# Altium schematic sheet Interface_BUS.SchDoc
size A4; Author: Audran; CompanyName: Goldorak; Address1: Electrolab; Address2: 52 rue Paul Lescop; Address3: 92000 Nanterre; DocumentNumber: 7; SheetNumber: 7; SheetTotal: 8; ProjectName: Cartes_2017
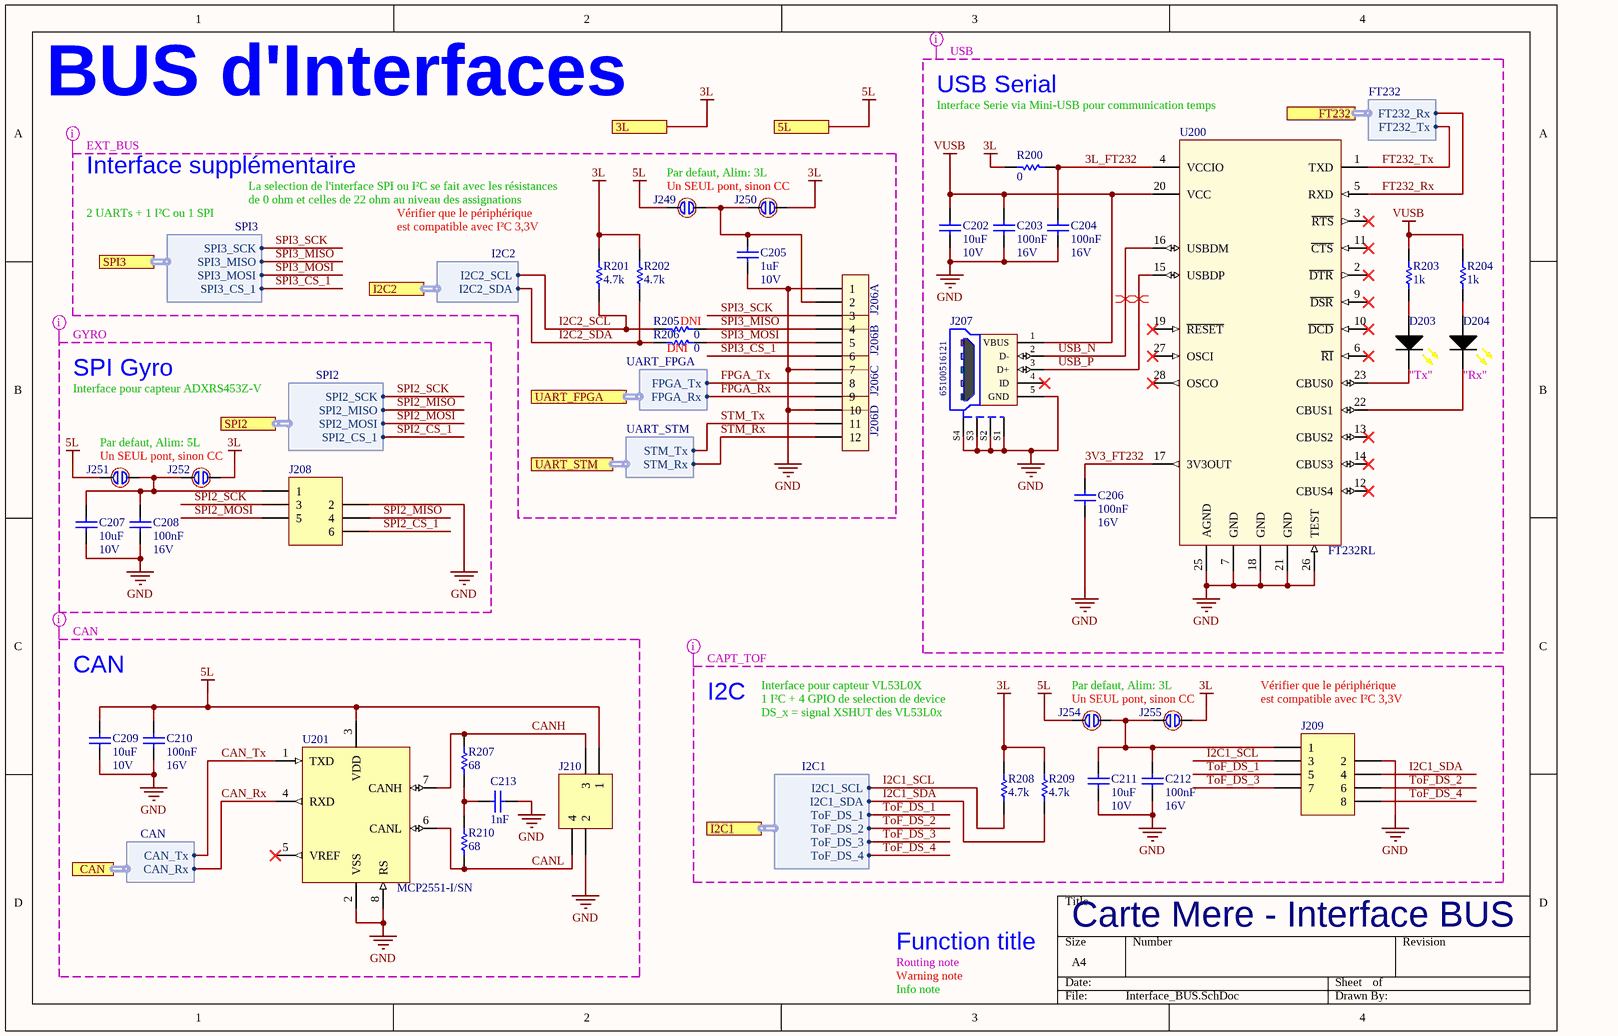
[diagram p0: Interface_BUS.SchDoc]

## Parts
C202  10uF  RatedVoltage: 10V  [WCAP-CSGP_0805, 2x1.25x1.25]
C203  100nF  RatedVoltage: 16V  [WCAP-CSGP_0402, 1x0.5x0.5]
C204  100nF  RatedVoltage: 16V  [WCAP-CSGP_0402, 1x0.5x0.5]
C205  1uF  RatedVoltage: 10V  [WCAP-CSGP_0402, 1x0.5x0.5]
C206  100nF  RatedVoltage: 16V  [WCAP-CSGP_0402, 1x0.5x0.5]
C207  10uF  RatedVoltage: 10V  [WCAP-CSGP_0805, 2x1.25x1.25]
C208  100nF  RatedVoltage: 16V  [WCAP-CSGP_0402, 1x0.5x0.5]
C209  10uF  RatedVoltage: 10V  [WCAP-CSGP_0805, 2x1.25x1.25]
C210  100nF  RatedVoltage: 16V  [WCAP-CSGP_0402, 1x0.5x0.5]
C211  10uF  RatedVoltage: 10V  [WCAP-CSGP_0805, 2x1.25x1.25]
C212  100nF  RatedVoltage: 16V  [WCAP-CSGP_0402, 1x0.5x0.5]
C213  1nF  [WCAP-CSGP_0402, 1x0.5x0.5]
D203  150060YS75000  [SMCW_0603]  (value not drawn)
D204  150060YS75000  [SMCW_0603]  (value not drawn)
J206  TSW-104-08-F-T-RA  [TSW-104-08-F-T-RA]  (value not drawn)  (parts A,B,C,D of 4)
J207  65100516121  [65100516121]
J208  690367280676  [690367280676]  (value not drawn)
J209  690367280876  [690367280876]  (value not drawn)
J210  690367280476  [690367280476]  (value not drawn)
J249  open  [CAVALIER]  (value not drawn)  (no BOM)
J250  open  [CAVALIER]  (value not drawn)  (no BOM)
J251  open  [CAVALIER]  (value not drawn)  (no BOM)
J252  open  [CAVALIER]  (value not drawn)  (no BOM)
J254  open  [CAVALIER]  (value not drawn)  (no BOM)
J255  open  [CAVALIER]  (value not drawn)  (no BOM)
R200  value 0  [RESC1608X06N]  (hidden comment: RC0603FR-070RL)
R201  value 4.7k  [RESC1005X04N]  (hidden comment: RC0402FR-074K7L)
R202  value 4.7k  [RESC1005X04N]  (hidden comment: RC0402FR-074K7L)
R203  value 1k  [RESC1005X04N]  (hidden comment: RC0402FR-071KL)
R204  value 1k  [RESC1005X04N]  (hidden comment: RC0402FR-071KL)
R205  value 0  [RESC1608X06N]  (hidden comment: RC0603FR-070RL)
R206  value 0  [RESC1608X06N]  (hidden comment: RC0603FR-070RL)
R207  value 68  [RESC1608X06N]  (hidden comment: RC0603FR-0768RL)
R208  value 4.7k  [RESC1005X04N]  (hidden comment: RC0402FR-074K7L)
R209  value 4.7k  [RESC1005X04N]  (hidden comment: RC0402FR-074K7L)
R210  value 68  [RESC1608X06N]  (hidden comment: RC0603FR-0768RL)
U200  FT232RL  [SSOP28]
U201  MCP2551-I/SN  [SOIC127P600X175-8N]

## Ports
3L, 5L, CAN (harness CAN), FT232 (harness FT232), I2C1 (harness I2C1), I2C2 (harness I2C2), SPI2 (harness SPI2), SPI3 (harness SPI3), UART_FPGA (harness UART_FPGA), UART_STM (harness UART_STM)

## Harnesses
I2C1: I2C1_SCL, I2C1_SDA, ToF_DS_1, ToF_DS_2, ToF_DS_3, ToF_DS_4
SPI2: SPI2_SCK, SPI2_MISO, SPI2_MOSI, SPI2_CS_1
CAN: CAN_Rx, CAN_Tx
FT232: FT232_Tx, FT232_Rx
SPI3: SPI3_SCK, SPI3_MISO, SPI3_MOSI, SPI3_CS_1
I2C2: I2C2_SCL, I2C2_SDA
UART_FPGA: FPGA_Tx, FPGA_Rx
UART_STM: STM_Tx, STM_Rx

## Nets
3L: J250.2 J252.2 J255.2 R200.1 R201.2 R202.2 R208.2 R209.2 ; port 3L
5L: C209.1 C210.1 J210.1 J249.1 J251.1 J254.1 U201.3(VDD) ; port 5L
GND: C202.2 C203.2 C204.2 C205.2 C206.2 C207.2 C208.2 C209.2 C210.2 C211.2 C212.2 C213.2 J206.1 J206.7 J206.10 J207.5(GND) J207.S1(Shield) J207.S2(Shield) J207.S3(Shield) J207.S4(Shield) J208.2 J209.2 J210.2 U200.7(GND) U200.18(GND) U200.21(GND) U200.25(AGND) U200.26(TEST) U201.2(VSS) U201.8(RS)
VUSB: C202.1 C203.1 J207.1(VBUS) R203.1 R204.1 U200.20(VCC)
3L_FT232: C204.1 R200.2 U200.4(VCCIO)
3V3_FT232: C206.1 U200.17(3V3OUT)
CAN_Rx: U201.4(RXD) ; port CAN.CAN_Rx
CAN_Tx: U201.1(TXD) ; port CAN.CAN_Tx
CANH: J210.3 R207.2 U201.7(CANH)
CANL: J210.4 R210.1 U201.6(CANL)
FPGA_Rx: J206.9 ; port UART_FPGA.FPGA_Rx
FPGA_Tx: J206.8 ; port UART_FPGA.FPGA_Tx
FT232_Rx: U200.5(RXD) ; port FT232.FT232_Rx
FT232_Tx: U200.1(TXD) ; port FT232.FT232_Tx
I2C1_SCL: J209.3 R208.1 ; port I2C1.I2C1_SCL
I2C1_SDA: J209.4 R209.1 ; port I2C1.I2C1_SDA
I2C2_SCL: R201.1 R205.1 ; port I2C2.I2C2_SCL
I2C2_SDA: R202.1 R206.1 ; port I2C2.I2C2_SDA
SPI2_CS_1: J208.6 ; port SPI2.SPI2_CS_1
SPI2_MISO: J208.4 ; port SPI2.SPI2_MISO
SPI2_MOSI: J208.5 ; port SPI2.SPI2_MOSI
SPI2_SCK: J208.3 ; port SPI2.SPI2_SCK
SPI3_CS_1: J206.6 ; port SPI3.SPI3_CS_1
SPI3_MISO: J206.4 R205.2 ; port SPI3.SPI3_MISO
SPI3_MOSI: J206.5 R206.2 ; port SPI3.SPI3_MOSI
SPI3_SCK: J206.3 ; port SPI3.SPI3_SCK
STM_Rx: J206.12 ; port UART_STM.STM_Rx
STM_Tx: J206.11 ; port UART_STM.STM_Tx
ToF_DS_1: J209.5 ; port I2C1.ToF_DS_1
ToF_DS_2: J209.6 ; port I2C1.ToF_DS_2
ToF_DS_3: J209.7 ; port I2C1.ToF_DS_3
ToF_DS_4: J209.8 ; port I2C1.ToF_DS_4
USB_N: J207.2(D-) U200.16(USBDM)
USB_P: J207.3(D+) U200.15(USBDP)
NetC205_1: C205.1 J206.2 J249.2 J250.1
NetC207_1: C207.1 C208.1 J208.1 J251.2 J252.1
NetC211_1: C211.1 C212.1 J209.1 J254.2 J255.1
NetC213_1: C213.1 R207.1 R210.2
NetD203_1: D203.1(C) U200.23(CBUS0)
NetD203_2: D203.2(A) R203.2
NetD204_1: D204.1(C) U200.22(CBUS1)
NetD204_2: D204.2(A) R204.2

Not connected (* = marked no-connect by the designer): J207 4(ID)*; U200 2(~{DTR})* 3(~{RTS})* 6(~{RI})* 9(~{DSR})* 10(~{DCD})* 11(~{CTS})* 12(CBUS4)* 13(CBUS2)* 14(CBUS3)* 19(~{RESET})* 27(OSCI)* 28(OSCO)*; U201 5(VREF)*

## Layout directives
differential pair: USB_N, USB_P
net class USB: 3L, 3L_FT232, 3V3_FT232, FT232_Rx, FT232_Tx, GND, USB_N, USB_P, VUSB
net class CAPT_TOF: 3L, 5L, GND, I2C1_SCL, I2C1_SDA, ToF_DS_1, ToF_DS_2, ToF_DS_3, ToF_DS_4
net class CAN: 5L, CAN_Rx, CAN_Tx, CANH, CANL, GND
net class GYRO: 3L, 5L, GND, SPI2_CS_1, SPI2_MISO, SPI2_MOSI, SPI2_SCK
net class EXT_BUS: 3L, 5L, FPGA_Rx, FPGA_Tx, GND, I2C2_SCL, I2C2_SDA, SPI3_CS_1, SPI3_MISO, SPI3_MOSI, SPI3_SCK, STM_Rx, STM_Tx

## Notes on the sheet
- BUS d'Interfaces
- USB Serial
- Interface Serie via Mini-USB pour communication temps
- Interface supplémentaire
- Par defaut, Alim: 3L
- 2 UARTs + 1 I²C ou 1 SPI
- (near J249) La selection de l'interface SPI ou I²C se fait avec les résistances
- de 0 ohm et celles de 22 ohm au niveau des assignations
- (near R201) Vérifier que le périphérique
- (near R201) est compatible avec I²C 3,3V
- Un SEUL pont, sinon CC
- SPI Gyro
- (near R206) DNI
- (near R205) DNI
- "Tx"
- (near D204) "Rx"
- Interface pour capteur ADXRS453Z-V
- Par defaut, Alim: 5L
- CAN
- I2C
- Interface pour capteur VL53L0X
- 1 I²C + 4 GPIO de selection de device
- DS_x = signal XSHUT des VL53L0x
- Vérifier que le périphérique
- (near J209) est compatible avec I²C 3,3V
- Routing note
- Warning note
- Function title
- Carte Mere - Interface BUS
- Info note

## Library data of the parts
C202 C207 C209 C211 = WCAP-CSGP, 885012207026: CAP CER 10uF 10V X7R 0805; Manufacturer: Wurth Elektronik; ComponentLink1Description: Datasheet; ComponentLink1URL: http://katalog.we-online.com/pbs/datasheet/885012207026.pdf; Manufacturer Part Number: 885012207026; Value: 10uF; Size: 0805; CeramicType: X7R; Supplier 1: Farnell; Supplier Part Number 1: 2495189; Supplier Part Number 2: C15850; Supplier 2: JLCPCB; Supplier Footprint 2: 0805
C203 C204 C206 C208 C210 C212 = WCAP-CSGP, 885012205037: CAP CER 100nF 16V X7R 0402; Manufacturer: Wurth Elektronik; ComponentLink1Description: Datasheet; ComponentLink1URL: http://katalog.we-online.com/pbs/datasheet/885012205037.pdf; Manufacturer Part Number: 885012205037; Value: 100nF; Size: 0402; CeramicType: X7R; Supplier 2: JLCPCB; Supplier Part Number 2: C1525; Supplier Footprint 2: 0402
C205 = WCAP-CSGP, 885012105012: CAP CER 1UF 10V X5R 0402; Manufacturer: Wurth Elektronik; ComponentLink1Description: Datasheet; ComponentLink1URL: http://katalog.we-online.com/pbs/datasheet/885012105012.pdf; Manufacturer Part Number: 885012105012; Value: 1uF; Size: 0402; CeramicType: X5R; Supplier 2: JLCPCB; Supplier Part Number 2: C52923; Supplier Footprint 2: 0402
C213 = WCAP-CSGP, 885012205061: CAP CER 1nF 50V X7R 0402; Manufacturer: Wurth Elektronik; ComponentLink1Description: Datasheet; ComponentLink1URL: http://katalog.we-online.com/pbs/datasheet/885012205061.pdf; Manufacturer Part Number: 885012205061; Value: 1nF; Size: 0402; CeramicType: X7R; RatedVoltage: 50V; Supplier 2: JLCPCB; Supplier Part Number 2: C1523; Supplier Footprint 2: 0402
D203 D204 = WL-SMCW 0603  150060YS75000: SMD mono-color Chip LED, WL-SMCW, Yellow; Manufacturer: Wurth Elektronik; Value: Jaune; Manufacturer Part Number: 150060YS75000; ComponentLink1Description: Datasheet; ComponentLink1URL: http://katalog.we-online.com/led/datasheet/150060YS75000.pdf; Supplier 1: Farnell; Supplier Part Number 1: 2322074; Supplier 2: JLCPCB; Supplier Part Number 2: C72038; Supplier Footprint 2: LED_0603
J206 = TSW-104-08-F-T-RA: CONN HEADER R/A 3L x 4POS 2.54MM; Manufacturer: SAMTEC; Manufacturer Part Number: TSW-104-08-F-T-RA; Supplier 1: Farnell; Supplier Part Number 1: 2053041; ComponentLink1Description: Datasheet; ComponentLink1URL: http://cloud.samtec.com/catalog_english/TSW_TH.PDF
J207 = 65100516121: Mini USB 2.0 Type B, Receptacle, Horizontal, SMT; Manufacturer: Wurth Elektronik; Value: 5; ComponentLink1Description: Manufacturer; ComponentLink1URL: https://www.we-online.com/catalog/en/COM_SMT_MINI_TYPE_B_HORIZONTAL/#65100516121; ComponentLink2Description: Datasheet; ComponentLink2URL: https://katalog.we-online.com/em/datasheet/65100516121.pdf; Manufacturer Part Number: 65100516121; Supplier 1: Farnell; Supplier Part Number 1: 1642036
J208 = 690367280676: WR-MM 6p Female SMT Connector with Polarization; Manufacturer: Wurth Electronics Inc.; Value: 6; ComponentLink1Description: Datasheet; ComponentLink1URL: http://katalog.we-online.de/em/datasheet/69036728xx76.pdf; Manufacturer Part Number: 690367280676; Supplier 1: Farnell; Supplier Part Number 1: 1641849
J209 = 690367280876: WR-MM 8p Female SMT Connector with Polarization; Manufacturer: Wurth Electronics Inc.; Value: 8; ComponentLink1Description: Datasheet; ComponentLink1URL: http://katalog.we-online.de/em/datasheet/69036728xx76.pdf; Manufacturer Part Number: 690367280876; Supplier 1: Farnell; Supplier Part Number 1: 1641850
J210 = 690367280476: WR-MM 4p Female SMT Connector with Polarization; Manufacturer: Wurth Electronics Inc.; Value: 4; ComponentLink1Description: Datasheet; ComponentLink1URL: http://katalog.we-online.de/em/datasheet/69036728xx76.pdf; Manufacturer Part Number: 690367280476; Supplier 1: Farnell; Supplier Part Number 1: 1641848
J249-J252 J254 J255 = CAVALIER_DOT: Cavalier soudure "ouvert", pastille fendue 1.2mm
R200 R205 R206 = RC0603FR-070RL: RES SMD 0 OHM 1% 1/10W 0603; Manufacturer: Yageo; Power: 100mW; Vmax: 50V; Manufacturer Part Number: RC0603FR-070RL; Type: Thick Film; ComponentLink1Description: Manufacturer; ComponentLink1URL: http://www.yageo.com/NewPortal/_en/index.jsp; ComponentLink2Description: Datasheet; ComponentLink2URL: http://www.farnell.com/datasheets/2167052.pdf; Supplier 1: Farnell; Precision: ±1%; Supplier Part Number 1: 2309106; Supplier 2: JLCPCB; Supplier Part Number 2: C21189; Supplier Footprint 2: 0603
R201 R202 R208 R209 = RC0402FR-074K7L: RES SMD 4K7 OHM 1% 1/16W 0402; Manufacturer: Yageo; Power: 63mW; Vmax: 50V; Type: Thick Film; ComponentLink1Description: Manufacturer; ComponentLink1URL: http://www.yageo.com/NewPortal/_en/index.jsp; ComponentLink2Description: Datasheet; ComponentLink2URL: http://www.farnell.com/datasheets/2167052.pdf; Manufacturer Part Number: RC0402FR-074K7L; Supplier 1: Farnell; Supplier Part Number 1: 9239316; Precision: ±1%; Supplier 2: JLCPCB; Supplier Part Number 2: C25900; Supplier Footprint 2: 0402
R203 R204 = RC0402FR-071KL: RES SMD 1K OHM 1% 1/16W 0402; Manufacturer: Yageo; Power: 63mW; Vmax: 50V; Type: Thick Film; ComponentLink1Description: Manufacturer; ComponentLink1URL: http://www.yageo.com/NewPortal/_en/index.jsp; ComponentLink2Description: Datasheet; ComponentLink2URL: http://www.farnell.com/datasheets/2167052.pdf; Manufacturer Part Number: RC0402FR-071KL; Supplier 1: Farnell; Supplier Part Number 1: 9239235; Precision: ±1%; Supplier 2: JLCPCB; Supplier Part Number 2: C11702; Supplier Footprint 2: 0402
R207 R210 = RC0603FR-0768RL: RES SMD 68 OHM 1% 1/10W 0603; Manufacturer: Yageo; Power: 100mW; Vmax: 50V; Manufacturer Part Number: RC0603FR-0768RL; Type: Thick Film; ComponentLink1Description: Manufacturer; ComponentLink1URL: http://www.yageo.com/NewPortal/_en/index.jsp; ComponentLink2Description: Datasheet; ComponentLink2URL: http://www.farnell.com/datasheets/1868787.pdf; Supplier 1: Farnell; Supplier Part Number 1: 9238344; Precision: ±1%; Supplier 2: JLCPCB; Supplier Part Number 2: C27592; Supplier Footprint 2: 0603
U200 = FT232RL: USB VERS UART CMS SSOP28 232; Manufacturer: FTDI; Manufacturer Part Number: FT232RL; Supplier 1: Farnell; Supplier Part Number 1: 1146032; ComponentLink1Description: Datasheet; ComponentLink1URL: http://www.farnell.com/datasheets/2007793.pdf; Supplier 2: JLCPCB; Supplier Footprint 2: SSOP-28_5.3x10.2x0.65P; Supplier Part Number 2: C8690
U201 = MCP2551-I/SN: IC TRANSCEIVER CAN HI-SPD 8-SOIC; Manufacturer: Microchip Technology; Manufacturer Part Number: MCP2551-I/SN; ComponentLink1Description: Datasheet; ComponentLink1URL: http://www.farnell.com/datasheets/657417.pdf; Supplier 1: Farnell; Supplier Part Number 1: 9758569; Supplier 2: JLCPCB; Supplier Part Number 2: C7439; Supplier Footprint 2: SOIC-8_3.9x4.9x1.27P